# Altium schematic sheet Schematic_HMI.SchDoc
size A3; PageSetup: Record=PageOptions|CenterHorizontal=True|CenterVertical=True|PrintScale=0.71|XCorrection=1.00|YCorrection=1.00|PrintKind=2|BorderSize=5000000|LeftOffset=0|BottomOffset=0|Orientation=2|PaperLength=1000|PaperWidth=1000|Scale=100|PaperSource=7|PrintQuality=-4|MediaType=1|DitherType=10|PrintScaleMode=1|PaperKind=A4 (210 x 297 mm)
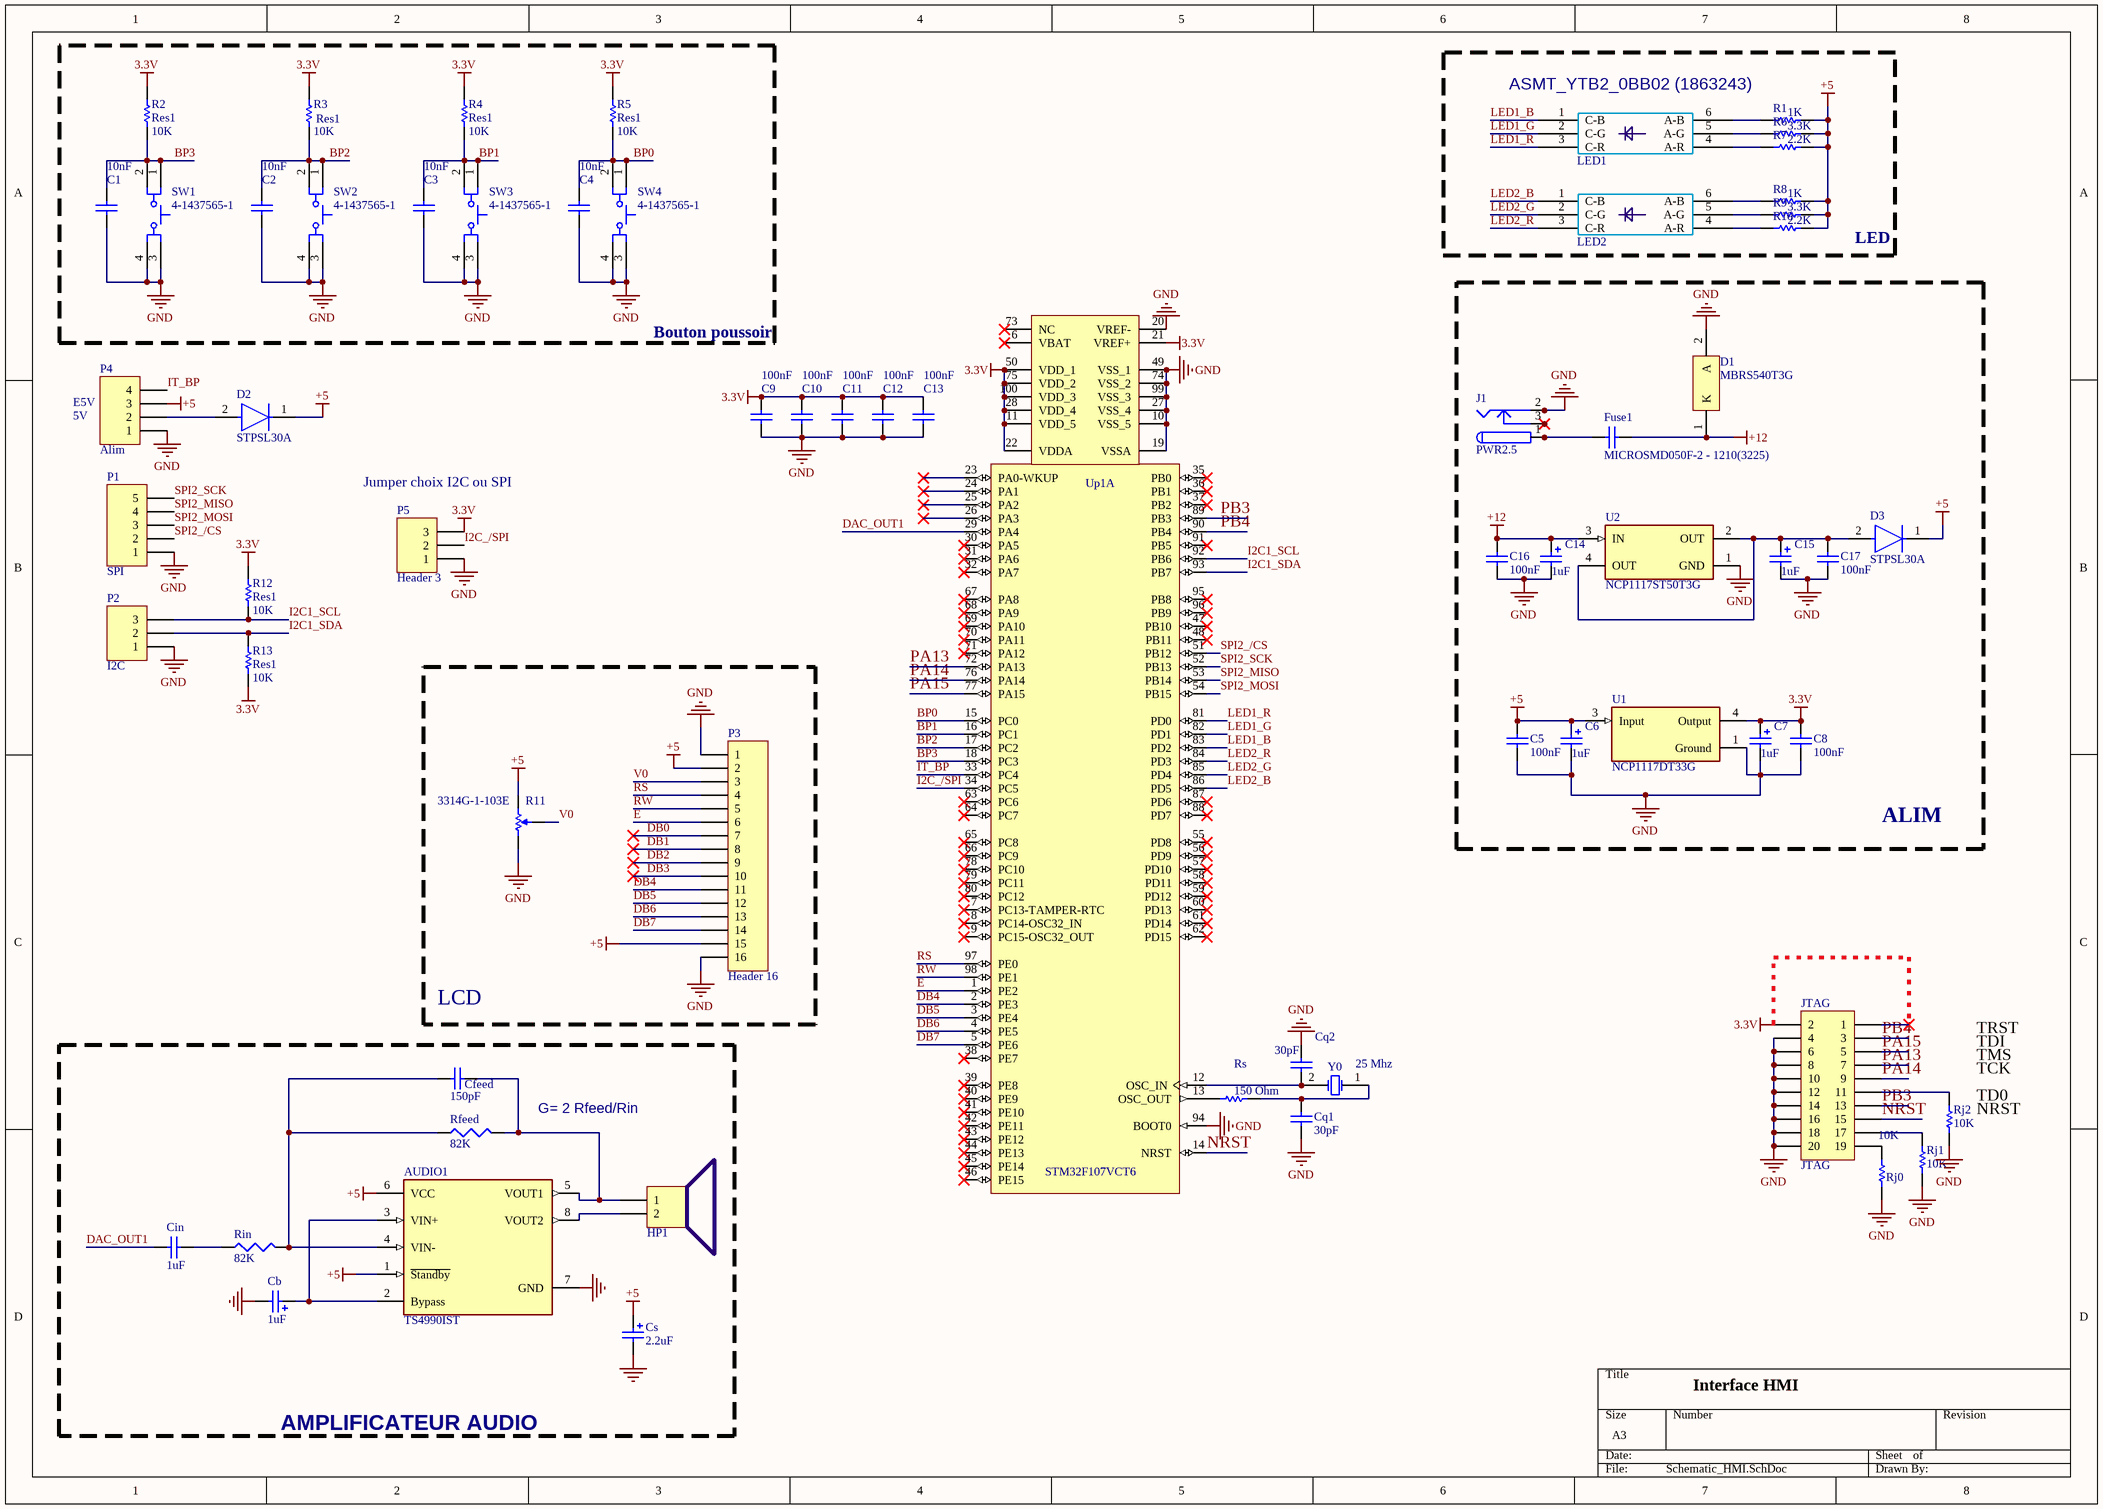
[diagram p0: Schematic_HMI.SchDoc]

## Parts
AUDIO1  TS4990IST  [FP-MiniSO-8-IPC_C]
C1  value 10nF  [c1206]  (hidden comment: Cap)
C2  value 10nF  [c1206]  (hidden comment: Cap)
C3  value 10nF  [c1206]  (hidden comment: Cap)
C4  value 10nF  [c1206]  (hidden comment: Cap)
C5  value 100nF  [c1206]  (hidden comment: Cap)
C6  value 1uF  [c1206]  (hidden comment: Cap Pol2)
C7  value 1uF  [c1206]  (hidden comment: Cap Pol2)
C8  value 100nF  [c1206]  (hidden comment: Cap)
C9  value 100nF  [c1206]  (hidden comment: Cap)
C10  value 100nF  [c1206]  (hidden comment: Cap)
C11  value 100nF  [c1206]  (hidden comment: Cap)
C12  value 100nF  [c1206]  (hidden comment: Cap)
C13  value 100nF  [c1206]  (hidden comment: Cap)
C14  value 1uF  [c1206]  (hidden comment: Cap Pol2)
C15  value 1uF  [c1206]  (hidden comment: Cap Pol2)
C16  value 100nF  [c1206]  (hidden comment: Cap)
C17  value 100nF  [c1206]  (hidden comment: Cap)
Cb  value 1uF  [c1206]  (hidden comment: Cap Pol2)
Cfeed  value 150pF  [c1206]  (hidden comment: Cap)
Cin  value 1uF  [c1206]  (hidden comment: Cap)
Cq1  value 30pF  [c1206]  (hidden comment: Cap)
Cq2  value 30pF  [c1206]  (hidden comment: Cap)
Cs  value 2.2uF  [c1206]  (hidden comment: Cap Pol2)
D1  MBRS540T3G  [ONSC-SMC-2-403-03_V]
D2  STPSL30A  [FP-95400-MFG]
D3  STPSL30A  [FP-95400-MFG]
Fuse1  MICROSMD050F-2 - 1210(3225)  [CAPC1210(3225)280_N]
HP1  MHDR1X2  [HDR1X2]  (value not drawn)
J1  PWR2.5  [KLD-0202]
JTAG  JTAG  [HDR2X10]
LED1  rgb  [rgb]  (value not drawn)
LED2  rgb  [rgb]  (value not drawn)
P1  SPI  [HDR1X5]
P2  I2C  [HDR1X3]
P3  Header 16  [HDR1X16]
P4  Alim  [HDR1X4]
P5  Header 3  [HDR1X3]
R1  value 1K  [c1206]  (hidden comment: Res1)
R2  Res1  value 10K  [c1206]
R3  Res1  value 10K  [c1206]
R4  Res1  value 10K  [c1206]
R5  Res1  value 10K  [c1206]
R6  value 3.3K  [c1206]  (hidden comment: Res1)
R7  value 2.2K  [c1206]  (hidden comment: Res1)
R8  value 1K  [c1206]  (hidden comment: Res1)
R9  value 3.3K  [c1206]  (hidden comment: Res1)
R10  value 2.2K  [c1206]  (hidden comment: Res1)
R11  3314G-1-103E  [BOUR-3314G-1_V]
R12  Res1  value 10K  [c1206]
R13  Res1  value 10K  [c1206]
Rfeed  value 82K  [c1206]  (hidden comment: Res3)
Rin  value 82K  [c1206]  (hidden comment: Res3)
Rj0  10K  [RESC1206(3216)_L]
Rj1  10K  [RESC1206(3216)_L]
Rj2  10K  [RESC1206(3216)_L]
Rs  value 150 Ohm  [RESC1206(3216)_L]
SW1  4-1437565-1  [TECO-4-1437565-1_V]
SW2  4-1437565-1  [TECO-4-1437565-1_V]
SW3  4-1437565-1  [TECO-4-1437565-1_V]
SW4  4-1437565-1  [TECO-4-1437565-1_V]
U1  NCP1117DT33G  [FP-369C-MFG]
U2  NCP1117ST50T3G  [FP-318H-MFG]
Up1  STM32F107VCT6  [LQFP100_N]  (parts A,B of 2)
Y0  25 Mhz  [hc49]

## Blocks framed on the sheet
Bouton poussoir: C1-C4 R2-R5 SW1-SW4
ALIM: C5-C8 C14-C17 D1 D3 Fuse1 J1 U1 U2
LCD: P3 R11
AMPLIFICATEUR AUDIO: AUDIO1 Cb Cfeed Cin Cs HP1 Rfeed Rin

## Nets
3.3V: C7.1 C8.2 C9.2 C10.2 C11.2 C12.2 C13.2 JTAG.2 P5.3 R2.2 R3.2 R4.2 R5.2 R12.2 R13.1 U1.4(Output) Up1.11(VDD_5) Up1.21(VREF+) Up1.22(VDDA) Up1.28(VDD_4) Up1.50(VDD_1) Up1.75(VDD_2) Up1.100(VDD_3)
+5: AUDIO1.1(~{Standby}) AUDIO1.6(VCC) C5.2 C6.1 Cs.1 D2.1(C) D3.1(C) P3.2 P3.15 P4.3 R1.1 R6.1 R7.1 R8.1 R9.1 R10.1 R11.3 U1.3(Input)
+12: C14.1 C16.2 D1.1(K) Fuse1.2 U2.3(IN)
GND: AUDIO1.7(GND) C1.1 C2.1 C3.1 C4.1 C5.1 C6.2 C7.2 C8.1 C9.1 C10.1 C11.1 C12.1 C13.1 C14.2 C15.2 C16.1 C17.1 Cb.2 Cq1.1 Cq2.2 Cs.2 D1.2(A) J1.2 J1.2A J1.2B JTAG.4 JTAG.6 JTAG.8 JTAG.10 JTAG.12 JTAG.14 JTAG.16 JTAG.18 JTAG.20 P1.1 P2.1 P3.1 P3.16 P4.1 P5.1 R11.1 Rj0.1 Rj1.2 Rj2.2 SW1.3 SW1.4 SW2.3 SW2.4 SW3.3 SW3.4 SW4.3 SW4.4 U1.1(Ground) U2.1(GND) Up1.10(VSS_5) Up1.19(VSSA) Up1.20(VREF-) Up1.27(VSS_4) Up1.49(VSS_1) Up1.74(VSS_2) Up1.94(BOOT0) Up1.99(VSS_3)
BP0: C4.2 R5.1 SW4.1 SW4.2 Up1.15(PC0)
BP1: C3.2 R4.1 SW3.1 SW3.2 Up1.16(PC1)
BP2: C2.2 R3.1 SW2.1 SW2.2 Up1.17(PC2)
BP3: C1.2 R2.1 SW1.1 SW1.2 Up1.18(PC3)
DAC_OUT1: Cin.2 Up1.29(PA4)
DB0: P3.7
DB1: P3.8
DB2: P3.9
DB3: P3.10
DB4: P3.11 Up1.2(PE3)
DB5: P3.12 Up1.3(PE4)
DB6: P3.13 Up1.4(PE5)
DB7: P3.14 Up1.5(PE6)
E: P3.6 Up1.1(PE2)
I2C1_SCL: P2.3 R12.1 Up1.92(PB6)
I2C1_SDA: P2.2 R13.2 Up1.93(PB7)
I2C_/SPI: P5.2 Up1.34(PC5)
IT_BP: P4.4 Up1.33(PC4)
LED1_B: LED1.1(C-B) Up1.83(PD2)
LED1_G: LED1.2(C-G) Up1.82(PD1)
LED1_R: LED1.3(C-R) Up1.81(PD0)
LED2_B: LED2.1(C-B) Up1.86(PD5)
LED2_G: LED2.2(C-G) Up1.85(PD4)
LED2_R: LED2.3(C-R) Up1.84(PD3)
NRST: JTAG.15 Up1.14(NRST)
PA13: JTAG.7 Up1.72(PA13)
PA14: JTAG.9 Up1.76(PA14)
PA15: JTAG.5 Up1.77(PA15)
PB3: JTAG.13 Up1.89(PB3)
PB4: JTAG.3 Up1.90(PB4)
RS: P3.4 Up1.97(PE0)
RW: P3.5 Up1.98(PE1)
SPI2_/CS: P1.2 Up1.51(PB12)
SPI2_MISO: P1.4 Up1.53(PB14)
SPI2_MOSI: P1.3 Up1.54(PB15)
SPI2_SCK: P1.5 Up1.52(PB13)
V0: P3.3 R11.2
NetAUDIO1_2: AUDIO1.2(Bypass) AUDIO1.3(VIN+) Cb.1
NetAUDIO1_4: AUDIO1.4(VIN-) Cfeed.2 Rfeed.1 Rin.2
NetAUDIO1_5: AUDIO1.5(VOUT1) Cfeed.1 HP1.1 Rfeed.2
NetAUDIO1_8: AUDIO1.8(VOUT2) HP1.2
NetC15_1: C15.1 C17.2 D3.2(A) U2.2(OUT) U2.4(OUT)
NetCin_1: Cin.1 Rin.1
NetCq1_2: Cq1.2 Rs.1 Y0.1(OSC1)
NetCq2_1: Cq2.1 Up1.12(OSC_IN) Y0.2(OSC2)
NetD2_2: D2.2(A) P4.2
NetFuse1_1: Fuse1.1 J1.1 J1.1A J1.1B
NetJ1_3: J1.3 J1.3A J1.3B
NetJTAG_11: JTAG.11 Rj2.1
NetJTAG_17: JTAG.17 Rj1.1
NetJTAG_19: JTAG.19 Rj0.2
NetLED1_4: LED1.4(A-R) R7.2
NetLED1_5: LED1.5(A-G) R6.2
NetLED1_6: LED1.6(A-B) R1.2
NetLED2_4: LED2.4(A-R) R10.2
NetLED2_5: LED2.5(A-G) R9.2
NetLED2_6: LED2.6(A-B) R8.2
NetRs_2: Rs.2 Up1.13(OSC_OUT)

Not connected (* = marked no-connect by the designer): JTAG 1*; Up1 6(VBAT)* 7(PC13-TAMPER-RTC)* 8(PC14-OSC32_IN)* 9(PC15-OSC32_OUT)* 23(PA0-WKUP)* 24(PA1)* 25(PA2)* 26(PA3)* 30(PA5)* 31(PA6)* 32(PA7)* 35(PB0)* 36(PB1)* 37(PB2)* 38(PE7)* 39(PE8)* 40(PE9)* 41(PE10)* 42(PE11)* 43(PE12)* 44(PE13)* 45(PE14)* 46(PE15)* 47(PB10)* 48(PB11)* 55(PD8)* 56(PD9)* 57(PD10)* 58(PD11)* 59(PD12)* 60(PD13)* 61(PD14)* 62(PD15)* 63(PC6)* 64(PC7)* 65(PC8)* 66(PC9)* 67(PA8)* 68(PA9)* 69(PA10)* 70(PA11)* 71(PA12)* 73(NC)* 78(PC10)* 79(PC11)* 80(PC12)* 87(PD6)* 88(PD7)* 91(PB5)* 95(PB8)* 96(PB9)*

## Notes on the sheet
- ASMT_YTB2_0BB02 (1863243)
- LED
- (near P4) E5V
- 5V
- (near P5) Jumper choix I2C ou SPI
- TDI
- TRST
- G= 2 Rfeed/Rin
- (near Rj2) TMS
- (near Rj2) TCK
- (near Rj2) TD0
- (near Rj2) NRST
- Interface HMI

## Library data of the parts
AUDIO1 = CMP-12130-000001-1: IC AMP AUDIO PWR 1.2W MONO 8MSOP; Manufacturer: STMicroelectronics; Gain Bandwidth: 1.5MHz; Standoff Height: 0mm; Max Junction Temp: +150°C; Min Supply Voltage: 2.2V; Power At Speaker R: 1.2W @ 8Ω; Number Of Channels: 1; Max Supply Voltage: 5.5V; Nominal Supply Current: 3.1-3.7mA; Mouser Description: Audio Amplifiers 1.2W Audio Power Amp; Lead Free: Yes; Manufacturer Part Number: TS4990IST; Temperature: -40°C to +85°C; ComponentLink2Description: Datasheet; Digikey Description: IC AMP AUDIO PWR 1.2W MONO 8MSOP; ComponentLink2URL: https://www.st.com/resource/en/datasheet/ts4990.pdf; Device Class L1: Integrated Circuits (ICs); Category: IC; Temperature Range Low: -40°C; Temperature Range High: +85°C; Device Class L3: Amplifiers - Audio; Height: 1.1mm; Ipc Land Pattern Name: SOP65P490X110-8; Automotive: No; Device Class L2: Linear ICs; Package: MiniSO-8; Octopart: https://octopart.com/ts4990ist-stmicroelectronics-407881; RoHS: TRUE
C1-C5 C8-C13 C16 C17 Cfeed Cin Cq1 Cq2 = Cap: Capacitor; Published: 8-Jun-2000; Publisher: Altium Limited
  C1-C5 C8-C13 C16 C17 Cq1 Cq2: LatestRevisionDate: 17-Jul-2002; LatestRevisionNote: Re-released for DXP Platform.; PackageReference: RAD-0.3; PackageDescription: Radial Cap, Thru-Hole; 2 Leads; 0.3 in Pin Spacing
  Cfeed Cin: Revision: July-2002: Re-released for DXP Platform.
C6 C7 C14 C15 Cb Cs = Cap Pol2: Polarized Capacitor (Axial); Published: 8-Jun-2000; LatestRevisionDate: 17-Jul-2002; LatestRevisionNote: Re-released for DXP Platform.; Publisher: Altium Limited
  C6 C7 C14 C15: PackageReference: POLAR0.8; PackageDescription: Polarized Capacitor; 2 Leads
D1 = CMP-1055-00390-1: Schottky Power Rectifier, 2-Pin SMC, Pb-Free, Tape and Reel; Manufacturer: On Semiconductor; Configuration: Single; IFSM Max (A): 190; ComponentLink1URL: http://www.onsemi.com/; ComponentLink3URL: http://www.onsemi.com/pub_link/Collateral/403-03.PDF; ComponentLink1Description: Manufacturer URL; PackageVersion: Rev. E, 08/2005; Packing: Tape and Reel; ComponentLink2URL: http://www.onsemi.cn/pub_link/Collateral/MBRS540T3-D.PDF; RoHS: TRUE; DatasheetVersion: Rev. 8; Mounting Technology: Surface Mount; ComponentLink3Description: Package Specification; ComponentLink2Description: Datasheet; PartNumber: MBRS540T3G; PackageDescription: 2-Pin Small Molded Package, J-Bend Lead, Body 5.845 x 6.855 mm; PackageReference: SMC-2-403-03
D2 D3 = CMP-02540-000045-1: DIODE GEN PURP 100V 1A DO214AC; Manufacturer Part Number: ES1B-E3/61T; Manufacturer: Vishay; Max Junction Temp: +150°C; Standoff Height: 0mm; Capacitance: 10pF; Peak Reverse Current: 5uA; Max Surge Forward Current: 30A; Value: 10pF; Reverse Voltage: 100V; RoHS: TRUE; Mouser Description: Diode Ultra Fast Recovery Rectifier 100V 1A 2-Pin DO-214AC T/R; Temperature Range Low: -55°C; Footprint Url: https://www.vishay.com/docs/95400/sma.pdf; ComponentLink2Description: Datasheet; Package: 95400; Max Repetitive Reverse Voltage: 100V; Octopart: https://octopart.com/es1b-e3%2F61t-vishay-39550258; Lead Free: Yes; Temperature: -55°C to +150°C; Height: 2.29mm; Device Class L1: Discrete Semiconductors; Category: Diode; Automotive: No; Device Class L2: Diodes; Forward Current: 1A; Temperature Range High: +150°C; ComponentLink2URL: http://www.vishay.com/docs/88586/es1.pdf; Digikey Description: DIODE GEN PURP 100V 1A DO214AC; Device Class L3: Rectifier Diodes
Fuse1 = CMP-1038-02104-1: MICROSMD050F-2 - 1210 (3225 Metric) Thickness 2.8mm SMD; Rated Voltage: 100 V; Value: 2.2uF; Case-Metric: 3225; Tolerance: Â±10%; Case-EIA: 1210; Technology: SMT; Max Thickness: 2.8 mm
HP1 = MHDR1X2: Header, 2-Pin; LatestRevisionDate: 17-Jul-2002; LatestRevisionNote: Re-released for DXP Platform.; Publisher: Altium Limited
J1 = PWR2.5: Low Voltage Power Supply Connector; Published: 17-Dec-2003; DatasheetDocument: 09-May-2002; Publisher: Altium Limited; ComponentLink1Description: Manufacturer Link; ComponentLink1URL: http://domino.kycon.com/internet/Products.html
JTAG = Header 10X2: Header, 10-Pin, Dual row; LatestRevisionDate: 17-Jul-2002; LatestRevisionNote: Re-released for DXP Platform.; Publisher: Altium Limited
P1 = Header 5: Header, 5-Pin; LatestRevisionDate: 17-Jul-2002; LatestRevisionNote: Re-released for DXP Platform.; Publisher: Altium Limited
P2 P5 = Header 3: Header, 3-Pin; LatestRevisionDate: 17-Jul-2002; LatestRevisionNote: Re-released for DXP Platform.; Publisher: Altium Limited
P3 = Header 16: Header, 16-Pin; LatestRevisionDate: 17-Jul-2002; LatestRevisionNote: Re-released for DXP Platform.; Publisher: Altium Limited
P4 = Header 4: Header, 4-Pin; LatestRevisionDate: 17-Jul-2002; LatestRevisionNote: Re-released for DXP Platform.; Publisher: Altium Limited
R1-R10 R12 R13 = Res1: Resistor; Published: 8-Jun-2000; LatestRevisionDate: 17-Jul-2002; LatestRevisionNote: Re-released for DXP Platform.; PackageReference: AXIAL-0.3; Publisher: Altium Limited; PackageDescription: Axial Device, Thru-Hole; 2 Leads; 0.3 in Pin Spacing
R11 = CMP-2000-05589-1: 4 mm Square Trimpot(R) Trimming Potentiometer, 5 KOhm, +/- 20%, 0.25 W, -55 to 125 degC, 3-Pin SMD, RoHS, Tape and Reel; Manufacturer: Bourns; Power: 250; Angle of rotation: 240°; Dielectric strength: 500; Resistance: 5; Curve: linear; Package Description: 3-Pin Surface Mount Device, Body 4.5 x 4.5 mm, Pitch 1.15 mm; Package Reference: 3314G-1; Mounting Technology: SurfaceMount; Datasheet URL: http://www.bourns.com/docs/Product-Datasheets/3314.pdf; Datasheet Version: 05/2016; Tolerance: ±20%; Manufacturer URL: http://www.bourns.com/; Temperature range: -55...+125°C; Package: GullWing
Rfeed Rin = Res3: Resistor; Published: 8-Jun-2000; Revision: July-2002: Re-released for DXP Platform.; Publisher: Altium Limited
Rj0-Rj2 = CMP-1014-00623-1: 10K 0.25W 1% 1206 (3216 Metric)  SMD; Case-Metric: 3216; Value: 10000.00 Ohm; Case-EIA: 1206; Power: 0.25 W; Technology: SMT; Tolerance: 1 %
Rs = CMP-1014-00623-1: 10K 0.25W 1% 1206 (3216 Metric)  SMD; Case-Metric: 3216; Case-EIA: 1206; Power: 0.25 W; Technology: SMT; Tolerance: 1 %
SW1-SW4 = CMP-2000-05602-1: Tactile Switch, 50 mA, 12 VDC, -20 to 85 degC, 4-Pin SMD, RoHS, Bulk; Manufacturer: TEConnectivity/AMPBrand; Illumination Type: N/R; Maximum Contact Resistance: 100mOhm; Actuator Style: RoundButton; Actuator Length: 1.4mm; Contact Rating @ Voltage: 0.05@12VDCA; Maximum DC Voltage Rating: 12V; Body Orientation: Straight; Ground Terminal: No; Dielectric Strength: 500VAC; Operating Force: 1.57N; Electrical Life: 100000Cycle; Mechanical Life: N/A; Family: FSMJSMA; Contact Material: CopperAlloy; Type: N/A; RoHS: Yes; Pole Throw Configuration: N/A; Operating Temperature: -20to85C; Minimum Insulation Resistance: 100MOhm; Package Description: 4-Pin Surface Mount Device, Body 6 x 6 mm, Pitch 9.1 mm; Housing Material: N/A; Switch Configuration: N/A; Mounting: SurfaceMount,GullWing; Datasheet URL: https://datasheet.ciiva.com/14635/0900766b80912216-14635826.pdf; Packaging: Bulk; Base Material: N/A; Actuator Color: N/A; Dimension: 6x10x5.25mm; Contact Plating: Silver; Seal Location: N/A; Mounting Technology: SurfaceMount; Part No: 4-1437565-1; Seal Description: N/A; Maximum AC Voltage Rating: N/A; Datasheet Version: 04/2007; Manufacturer URL: http://www.te.com/; Package Reference: 4-1437565-1; Product Weight: N/A
U1 = CMP-07128-000008-1: IC REG LINEAR 3.3V 1A DPAK; Manufacturer: ON Semiconductor; Dropout Voltage: 1.2V; Nominal Supply Current: 6mA; Number Of Outputs: 1; Max Supply Voltage: 20V; Max Junction Temp: +150°C; Min Supply Voltage: 2.4V; Accuracy Percentage: 1%; Output Type: Fixed; Standoff Height: 0mm; Package: 369C; Lead Free: Yes; Temperature Range Low: -55°C; Automotive: No; Digikey Description: IC REG LINEAR 3.3V 1A DPAK; ComponentLink2Description: Datasheet; Footprint Url: https://www.onsemi.com/pub/Collateral/369C.PDF; Output Voltage: 3.3V; Manufacturer Part Number: NCP1117DT33G; Device Class L2: Power Management ICs; RoHS: TRUE; Device Class L3: Voltage Regulators - Linear; Mouser Description: LDO Voltage Regulators 3.3V 1A Positive; Output Current: 1A; Ambient Temperature Range Low: 0°C; Height: 2.51mm; Octopart: https://octopart.com/ncp1117dt33g-on+semiconductor-1381653; Temperature Range High: +150°C; Temperature: -55°C to +150°C; Device Class L1: Integrated Circuits (ICs); ComponentLink2URL: https://www.onsemi.jp/PowerSolutions/document/NCP1117-D.PDF; Ambient Temperature Range High: +125°C; Category: IC
U2 = CMP-0592-00001-3: IC REG LINEAR 5V 1A SOT223; Output Type: Fixed; Quiescent Current: 10mA; Number of Outputs: 1; Polarity: Positive; Min Input Voltage: 3.5V; Input Bias Current: 6mA; Dropout Voltage: 1.2V; Power Rating: 781mW; Accuracy: 1%; Max Input Voltage: 20V; Max Output Current: 1A; Output Current: 1A; Packaging: Tape and Reel; Contact Plating: Tin; Package Quantity: 1; Halogen Free: Halogen Free; Case/Package: SOT-223; Radiation Hardening: No; Min Operating Temperature: 0°C; Min Current Limit: 1A; Max Operating Temperature: 125°C; Number of Regulators: 1; Number of Pins: 4; Width: 3.7mm; Lead Free: Lead Free; Output Voltage Accuracy: 1%; REACH SVHC: No SVHC; Length: 6.7mm; Output Voltage: 5V; Tolerance: 1%; Height: 1.69mm; Nominal Output Voltage: 5V
Up1 = CMP-0237-00081-1: STM32 ARM-based 32-bit MCU Connectivity Line & Ethernet with 256 kB Flash, 64 kB Internal RAM, -40 to +85°C Temperature, 100-Pin LQFP, Tray; ComponentLink2URL: www.st.com/stm32; PackageDescription: 100-Pin Low-Profile Quad Flat Pack, 14 x 14 mm Body, 0.5 mm Pitch (LQFP100); ComponentLink1Description: STM32F105/107 Datasheet; DatasheetVersion: rev5.0, May-2010; ComponentLink1URL: http://www.st.com/internet/com/TECHNICAL_RESOURCES/TECHNICAL_LITERATURE/DATASHEET/CD00220364.pdf; PackageVersion: rev13, Apr-2011; ComponentLink3Description: st.com Home; ComponentLink2Description: STM32 Family Web Page; ComponentLink3URL: http://www.st.com/internet/com/home/home.jsp; PackageReference: LQFP100
Y0 = HC49/4H_SMX: Surface Mount Quartz Crystal; Note: PCB layout complies with manufacturer's recommendation.; Published: 17-Jul-2002; DatasheetDocument: 18-Oct-1999; PackageDocument: 18-Oct-1999; PackageReference: HC49/4H_SMX; Publisher: Altium Limited; ComponentLink1Description: Manufacturer Link; ComponentLink1URL: http://www.cmac.com/mt/; ComponentLink2Description: Datasheet; ComponentLink2URL: http://www.cmac.com/mt/databook/crystals/smd/hc49_4h_smx.pdf